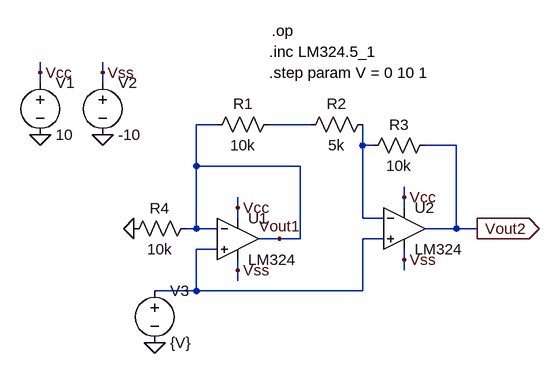
[diagram p0: schematic TPSRA1.3.asc]
TPSRA1.3.asc, the LTspice schematic file:
Version 4
SHEET 1 880 680
WIRE -224 -112 -224 -128
WIRE -128 -112 -128 -128
WIRE -224 -96 -224 -112
WIRE -128 -96 -128 -112
WIRE 48 -32 16 -32
WIRE 192 -32 128 -32
WIRE 272 0 272 -32
WIRE 288 0 272 0
WIRE 416 0 368 0
WIRE 16 32 16 -32
WIRE 176 32 16 32
WIRE 336 80 336 64
WIRE 80 96 80 80
WIRE 336 96 336 80
WIRE 80 112 80 96
WIRE 272 112 272 0
WIRE 304 112 272 112
WIRE 16 128 16 32
WIRE 16 128 0 128
WIRE 48 128 16 128
WIRE 416 128 416 0
WIRE 416 128 368 128
WIRE 448 128 416 128
WIRE 144 144 112 144
WIRE 176 144 176 32
WIRE 176 144 144 144
WIRE 304 144 272 144
WIRE 48 160 16 160
WIRE 336 176 336 160
WIRE 80 192 80 176
WIRE 336 192 336 176
WIRE 80 208 80 192
WIRE 16 224 16 160
WIRE 16 224 -48 224
WIRE 272 224 272 144
WIRE 272 224 16 224
FLAG -80 128 0
FLAG 448 128 Vout2
IOPIN 448 128 Out
FLAG -128 -16 0
FLAG -224 -16 0
FLAG -224 -112 Vcc
FLAG -128 -112 Vss
FLAG 80 96 Vcc
FLAG 80 192 Vss
FLAG 336 80 Vcc
FLAG 336 176 Vss
FLAG -48 304 0
FLAG 144 144 Vout1
SYMBOL Opamps\\opamp2 80 80 R0
SYMATTR InstName U1
SYMATTR Value LM324
SYMBOL Opamps\\opamp2 336 64 R0
SYMATTR InstName U2
SYMATTR Value LM324
SYMBOL res 144 -48 R90
WINDOW 0 0 56 VBottom 2
WINDOW 3 32 56 VTop 2
SYMATTR InstName R1
SYMATTR Value 10k
SYMBOL res 288 -48 R90
WINDOW 0 0 56 VBottom 2
WINDOW 3 32 56 VTop 2
SYMATTR InstName R2
SYMATTR Value 5k
SYMBOL res 384 -16 R90
WINDOW 0 0 56 VBottom 2
WINDOW 3 32 56 VTop 2
SYMATTR InstName R3
SYMATTR Value 10k
SYMBOL res 16 112 R90
WINDOW 0 0 56 VBottom 2
WINDOW 3 32 56 VTop 2
SYMATTR InstName R4
SYMATTR Value 10k
SYMBOL voltage -224 -112 R0
SYMATTR InstName V1
SYMATTR Value 10
SYMBOL voltage -128 -112 R0
SYMATTR InstName V2
SYMATTR Value -10
SYMBOL voltage -48 208 R0
SYMATTR InstName V3
SYMATTR Value {V}
TEXT 128 -144 Left 2 !.inc LM324.5_1
TEXT 128 -112 Left 2 !.step param V = 0 10 1
TEXT 132 -176 Left 2 !.op

The netlist it stands for:
* TPSRA1.3.asc
XU1 N003 Vout1 Vcc Vss Vout1 LM324  ; pins In+ In- V+ V- OUT
XU2 N003 N002 Vcc Vss Vout2 LM324  ; pins In+ In- V+ V- OUT
R1 N001 Vout1 10k
R2 N002 N001 5k
R3 Vout2 N002 10k
R4 Vout1 0 10k
V1 Vcc 0 10
V2 Vss 0 -10
V3 N003 0 {V}
.inc LM324.5_1
.step param V = 0 10 1
.op
.backanno
.end